# EAGLE design room_sensor (EAGLE 9.6.2)
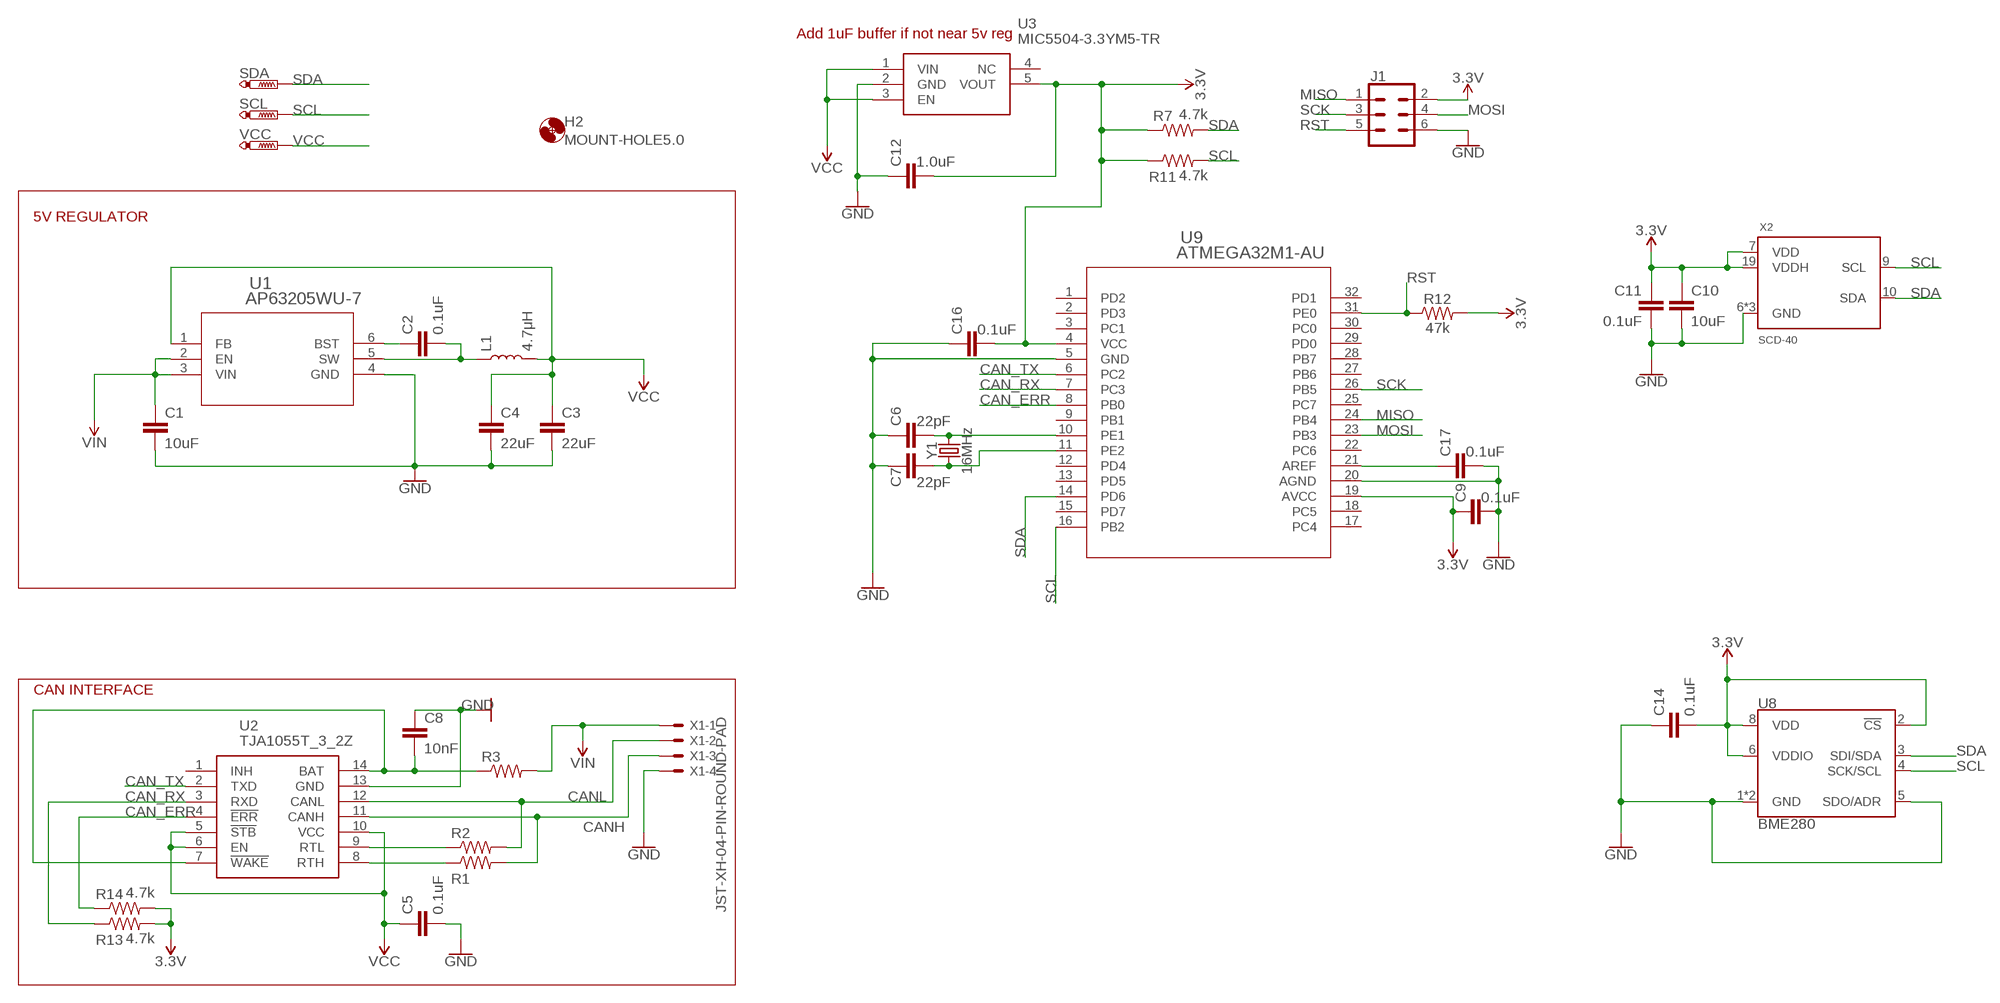
[diagram p0: schematic, sheet 1]

## Parts
C1  10uF  10UF-1210-50V-20%  [1210]
C2  0.1uF  0.1UF-0603-25V-5%  [0603]
C3  22uF  22UF-0805-6.3V-20%  [0805]
C4  22uF  22UF-0805-6.3V-20%  [0805]
C5  0.1uF  0.1UF-0603-25V-5%  [0603]
C6  22pF  22PF-0603-50V-5%  [0603]
C7  22pF  22PF-0603-50V-5%  [0603]
C8  10nF  10NF-0603-50V-10%  [0603]
C9  0.1uF  0.1UF-0603-25V-5%  [0603]
C10  10uF  10UF-1210-50V-20%  [1210]
C11  0.1uF  0.1UF-0603-25V-5%  [0603]
C12  1.0uF  1.0UF-0603-16V-10%  [0603]
C14  0.1uF  0.1UF-0603-25V-5%  [0603]
C16  0.1uF  0.1UF-0603-25V-5%  [0603]
C17  0.1uF  0.1UF-0603-25V-5%  [0603]
H2  MOUNT-HOLE5.0  [5,0]
J1  CONN_03X2NO_SILK  [2X3-NS]
L1  4.7μH  4.7μH_SHIELDED_INDUCTORNPIS_LS  [INDUCTOR_4X4MM]
R1  RESISTOR0603  [0603]
R2  RESISTOR0603  [0603]
R3  RESISTOR0603  [0603]
R7  4.7k  4.7KOHM-0603-1/10W-1%  [0603]
R11  4.7k  4.7KOHM-0603-1/10W-1%  [0603]
R12  47k  47KOHM-0603-1/10W-1%  [0603]
R13  4.7k  4.7KOHM-0603-1/10W-1%  [0603]
R14  4.7k  4.7KOHM-0603-1/10W-1%  [0603]
SCL  PTR1B1,27  [B1,27]
SDA  PTR1B1,27  [B1,27]
U1  AP63205WU-7  [SOIC_05WU-7_DIO]
U2  TJA1055T_3_2Z  [SOIC127P600X175-14N]
U3  MIC5504-3.3YM5-TR  [SOT95P280X145-5N]
U8  BME280  [LGA-8-2.5X2.5]
U9  ATMEGA32M1-AU  [32A_ATM]
VCC  PTR1B1,27  [B1,27]
X1  JST-XH-04-PIN-ROUND-PAD  [JST-XH-04-PACKAGE-ROUND-PAD]
X2  SCD-40  [SCD40]
Y1  16MHz  CRYSTAL-16MHZSMD-5X3.2  [CRYSTAL-SMD-5X3.2-4PAD]

## Nets
3.3V: C9.1 C10.1 C11.2 C12.2 C14.2 C16.2 J1.2 R7.1 R11.1 R12.2 R13.2 R14.2 U3.5(VOUT) U8.2(!CS) U8.6(VDDIO) U8.8(VDD) U9.4(VCC) U9.19(AVCC) X2.7(VDD) X2.19(VDDH)
CAN_ERR: R14.1 U2.4(!ERR) U9.8(PB0)
CAN_RX: R13.1 U2.3(RXD) U9.7(PC3)
CAN_TX: U2.2(TXD) U9.6(PC2)
CANH: R1.2 U2.11(CANH) X1.3
CANL: R2.2 U2.12(CANL) X1.2
GND: C1.2 C3.2 C4.2 C5.2 C6.1 C7.1 C8.1 C9.2 C10.2 C11.1 C12.1 C14.1 C16.1 C17.2 J1.6 U1.4(GND) U2.13(GND) U3.2(GND) U8.1(GND) U8.5(SDO/ADR) U8.7(GND) U9.5(GND) U9.20(AGND) X1.4 X2.6(GND) X2.20(GND) X2.P$1(GND)
MISO: J1.1 U9.24(PB4)
MOSI: J1.4 U9.23(PB3)
N$1: C2.2 L1.P$1 U1.5(SW)
N$2: C2.1 U1.6(BST)
N$3: C6.2 U9.10(PE1) Y1.3
N$4: C7.2 U9.11(PE2) Y1.1
N$5: R2.1 U2.9(RTL)
N$6: R1.1 U2.8(RTH)
N$8: C8.2 R3.1 U2.7(!WAKE) U2.14(BAT)
N$20: C17.1 U9.21(AREF)
RST: J1.5 R12.1 U9.31(PE0)
SCK: J1.3 U9.26(PB5)
SCL: R11.2 SCL.TP U8.4(SCK/SCL) U9.16(PB2) X2.9(SCL)
SDA: R7.2 SDA.TP U8.3(SDI/SDA) U9.14(PD6) X2.10(SDA)
VCC: C3.1 C4.1 C5.1 L1.P$2 U1.1(FB) U2.5(!STB) U2.6(EN) U2.10(VCC) U3.1(VIN) U3.3(EN) VCC.TP
VIN: C1.1 R3.2 U1.2(EN) U1.3(VIN) X1.1
Unconnected: U2.1(INH) U3.4(NC) U9.1(PD2) U9.2(PD3) U9.3(PC1) U9.9(PB1) U9.12(PD4) U9.13(PD5) U9.15(PD7) U9.17(PC4) U9.18(PC5) U9.22(PC6) U9.25(PC7) U9.27(PB6) U9.28(PB7) U9.29(PD0) U9.30(PC0) U9.32(PD1)

## Notes on the sheet
- Add 1uF buffer if not near 5v reg
- 5V REGULATOR
- CAN INTERFACE

## Library data of the parts
C1 C10 = SparkFun-Capacitors:10UF: 10.0µF ceramic capacitors A capacitor is a passive two-terminal electrical component used to store electrical energy temporarily in an electric field.; PROD_ID: CAP-09824
C2 C5 C9 C11 C14 C16 C17 = SparkFun-Capacitors:0.1UF: 0.1µF ceramic capacitors A capacitor is a passive two-terminal electrical component used to store electrical energy temporarily in an electric field.; PROD_ID: CAP-08604
C3 C4 = SparkFun-Capacitors:22UF: 22µF ceramic capacitors A capacitor is a passive two-terminal electrical component used to store electrical energy temporarily in an electric field.; PROD_ID: CAP-08402
C6 C7 = SparkFun-Capacitors:22PF: 22pF ceramic capacitors A capacitor is a passive two-terminal electrical component used to store electrical energy temporarily in an electric field.; PROD_ID: CAP-07876
C8 = SparkFun-Capacitors:10NF: 0.01uF/10nF/10,000pF ceramic capacitors A capacitor is a passive two-terminal electrical component used to store electrical energy temporarily in an electric field. CAP-09321; PROD_ID: CAP-00867
C12 = SparkFun-Capacitors:1.0UF: 1µF ceramic capacitors A capacitor is a passive two-terminal electrical component used to store electrical energy temporarily in an electric field.; PROD_ID: CAP-00868
H2 = holes:MOUNT-HOLE: MOUNTING HOLE with drill center marker
J1 = SparkFun-Connectors:CONN_03X2: Multi connection point. Often used as Generic Header-pin footprint for 0.1 inch spaced/style header connections You can populate with any combo of single row headers, but if you'd like an exact match, check these: Header - 2x3 (Male, 0.1") <https://www.sparkfun.com/products/12807> (PRT-12807) Header - 2x3 (Female, 0.1") <https://www.sparkfun.com/products/13010> (PRT-13010) 2x3 Pin Shrouded Header <https://www.sparkfun.com/products/10877> (PRT-10877) On any of the 0.1 inch spaced packages, you can populate with these: Break Away Headers - Straight <https://www.sparkfun.com/products/116> (PRT-00116) Break Away Male Headers - Right Angle <https://www.sparkfun.com/products/553> (PRT-00553) Female Headers <https://www.sparkfun.com/products/115> (PRT-00115) Break Away Headers - Machine Pin <https://www.sparkfun.com/products/117> (PRT-00117) Break Away Female Headers - Swiss Machine Pin <https://www.sparkfun.com/products/743> (PRT-00743) Special note: the shrouded connector mates well with our 3x2 ribbon cables: Ribbon Crimp Connector - 6-pin (2x3, Female) <https://www.sparkfun.com/products/10651> (PRT-10651) Ribbon Cable - 6 wire (15ft) <https://www.sparkfun.com/products/10646> (PRT-10646)
L1 = SparkFun-Coils:4.7μH_SHIELDED_INDUCTOR: 4.7uH Inductor 4.7uH 1.4A 50mOhm 1008(2520) Package Shielded; PROD_ID: NDUC-15245
R1-R3 = SparkFun-Resistors:RESISTOR: Generic Resistor Package
R7 R11 R13 R14 = SparkFun-Resistors:4.7KOHM: 4.7kΩ resistor A resistor is a passive two-terminal electrical component that implements electrical resistance as a circuit element. Resistors act to reduce current flow, and, at the same time, act to lower voltage levels within circuits. - Wikipedia; PROD_ID: RES-07857
R12 = SparkFun-Resistors:47KOHM: 47kΩ resistor A resistor is a passive two-terminal electrical component that implements electrical resistance as a circuit element. Resistors act to reduce current flow, and, at the same time, act to lower voltage levels within circuits. - Wikipedia; PROD_ID: RES-07871
SCL SDA VCC = testpad:PTR1: TEST PIN
U1 = Diodes buck converter:AP63205WU-7; COPYRIGHT: Copyright (C) 2023 Ultra Librarian. All rights reserved.; MANUFACTURER_PART_NUMBER: AP63205WU-7; MFR_NAME: Diodes Inc
U2 = TJA1055T_3_2Z:TJA1055T_3_2Z: CAN Interface IC Enhanced fault-tolerant CAN transceiver Source: Datasheet <http://www.nxp.com/docs/en/data-sheet/TJA1055.pdf>; DESCRIPTION: CAN Interface IC Enhanced fault-tolerant CAN transceiver; HEIGHT: 1.75mm; MANUFACTURER_NAME: NXP; MANUFACTURER_PART_NUMBER: TJA1055T/3/2Z; MOUSER_PART_NUMBER: 771-TJA1055T/3/2Z; MOUSER_PRICE-STOCK: https://www.mouser.co.uk/ProductDetail/NXP-Semiconductors/TJA1055T-3-2Z?qs=qSfuJ%252Bfl%2Fd73Y%2FIsMw3Ayg%3D%3D
U3 = MIC5504-3.3YM5-TR:MIC5504-3.3YM5-TR: MICROCHIP - MIC5504-3.3YM5-TR - LDO VOLT REG, 0.3A, 3.3V, SOT-23-5 Source: Datasheet <https://componentsearchengine.com/Datasheets/2/MIC5504-3.3YM5-TR.pdf>; DESCRIPTION: MICROCHIP - MIC5504-3.3YM5-TR - LDO VOLT REG, 0.3A, 3.3V, SOT-23-5; HEIGHT: 1.45mm; MANUFACTURER_NAME: Microchip; MANUFACTURER_PART_NUMBER: MIC5504-3.3YM5-TR; MOUSER_PART_NUMBER: 998-MIC5504-3.3YM5TR; MOUSER_PRICE-STOCK: https://www.mouser.co.uk/ProductDetail/Microchip-Technology/MIC5504-3.3YM5-TR?qs=U6T8BxXiZAUmVQ5Zs217qQ%3D%3D
U8 = SparkFun-Sensors:BME280: Bosch BME280 – Combined Humidity and Pressure Sensor The BME280 is as combined digital humidity, pressure and temperature sensor based on proven sensing principles. The sensor module is housed in an extremely compact metal-lid LGA package with a footprint of only 2.5×2.5mm² with a height of 0.93mm. Its small dimensions and its low power consumption allow the implementation in battery driven devices such as handsets, GPS modules or watches. Datasheet <https://cdn.sparkfun.com/assets/learn_tutorials/4/1/9/BST-BME280_DS001-10.pdf> SparkFun Products SparkFun Atmospheric Sensor Breakout - BME280 <https://www.sparkfun.com/products/13676> (SEN-13676); PROD_ID: IC-13090
U9 = ATMEGA31M1-AU:ATMEGA32M1-AU; COPYRIGHT: Copyright (C) 2023 Ultra Librarian. All rights reserved.; MANUFACTURER_PART_NUMBER: ATMEGA32M1-AU; MFR_NAME: Microchip
X1 = Rembrandt Electronics - JST XH Connectors v1-0:JST-XH-04-PIN: JST XH Connector 2 Pin Wire to board connector. Pitch: 2,54 mm, (0.100") Number of pins: 4 Created by Rembrandt Electronics www.rembrandtelectronics.com
X2 = Adafruit SCD-41:SCD-40
Y1 = SparkFun-Clocks:CRYSTAL-16MHZ: 16MHz Crystal Digikey Example <http://www.digikey.com/product-search/en?keywords=535-9122-1-ND> Frequency: 16MHz Frequency Stability: ±50ppm Frequency Tolerance: ±20ppm Load Capacitance: 18pF SparkFun Products: Pro Micro -5V/16MHz <https://www.sparkfun.com/products/12640> SparkFun Serial Enabled LCD Kit <https://www.sparkfun.com/products/10097>; PROD_ID: XTAL-08218; SF_ID: COM-00094

## Board
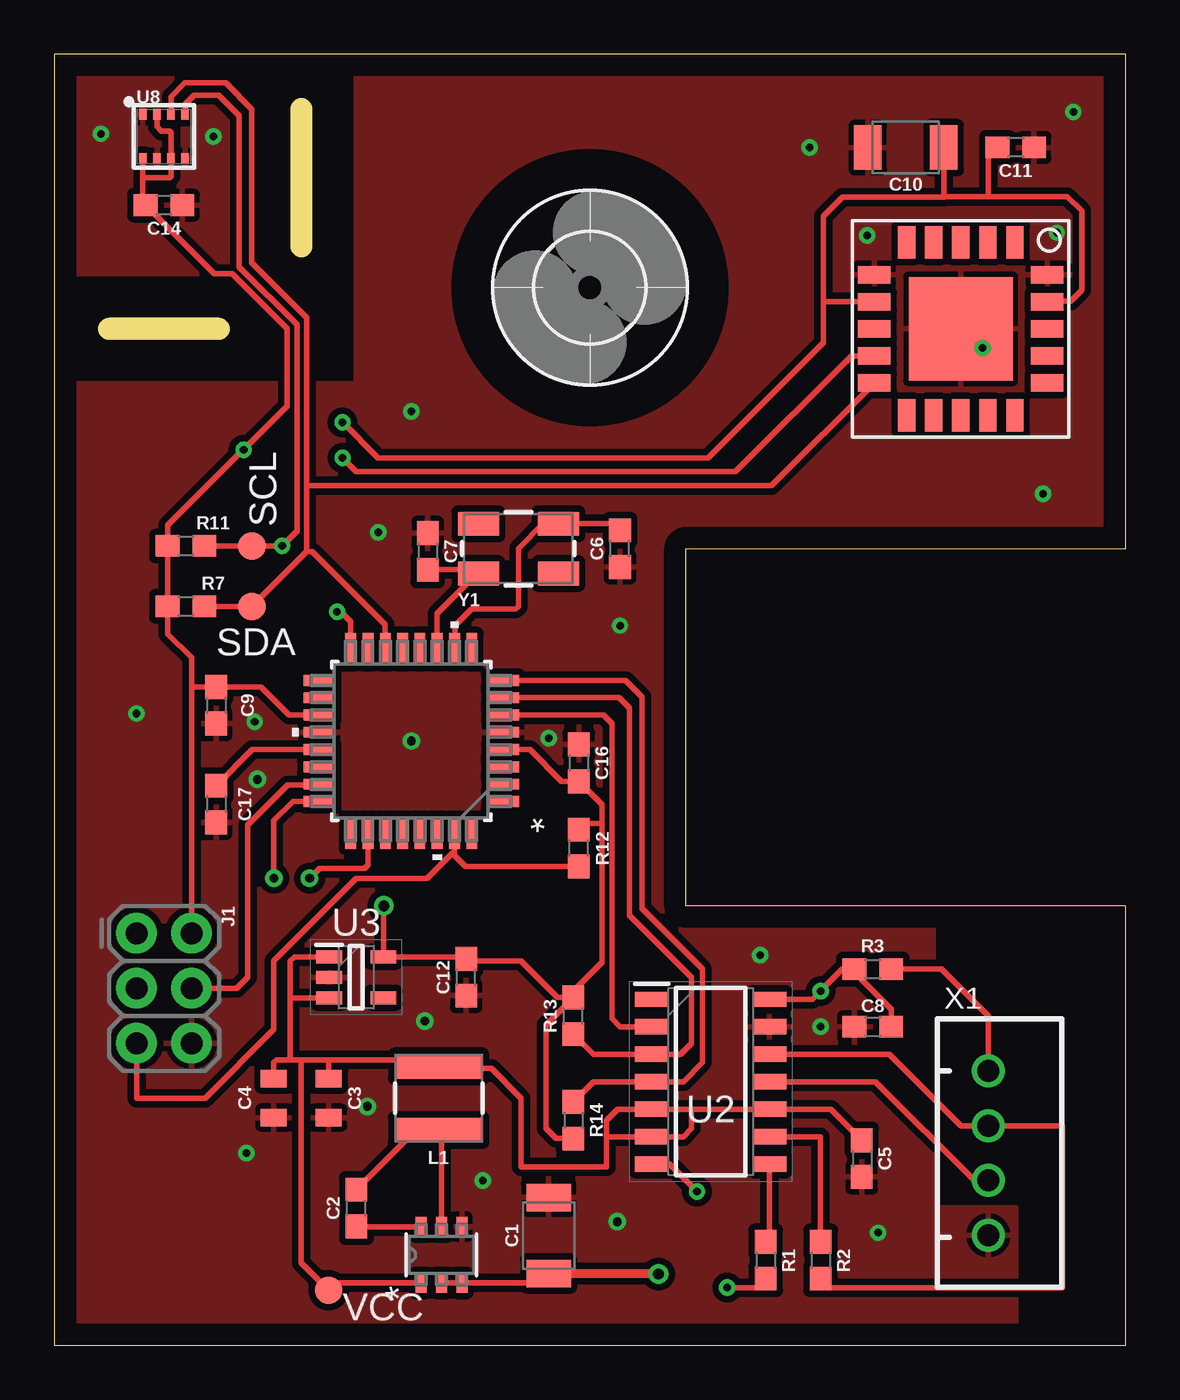
[diagram p1: board, top side]
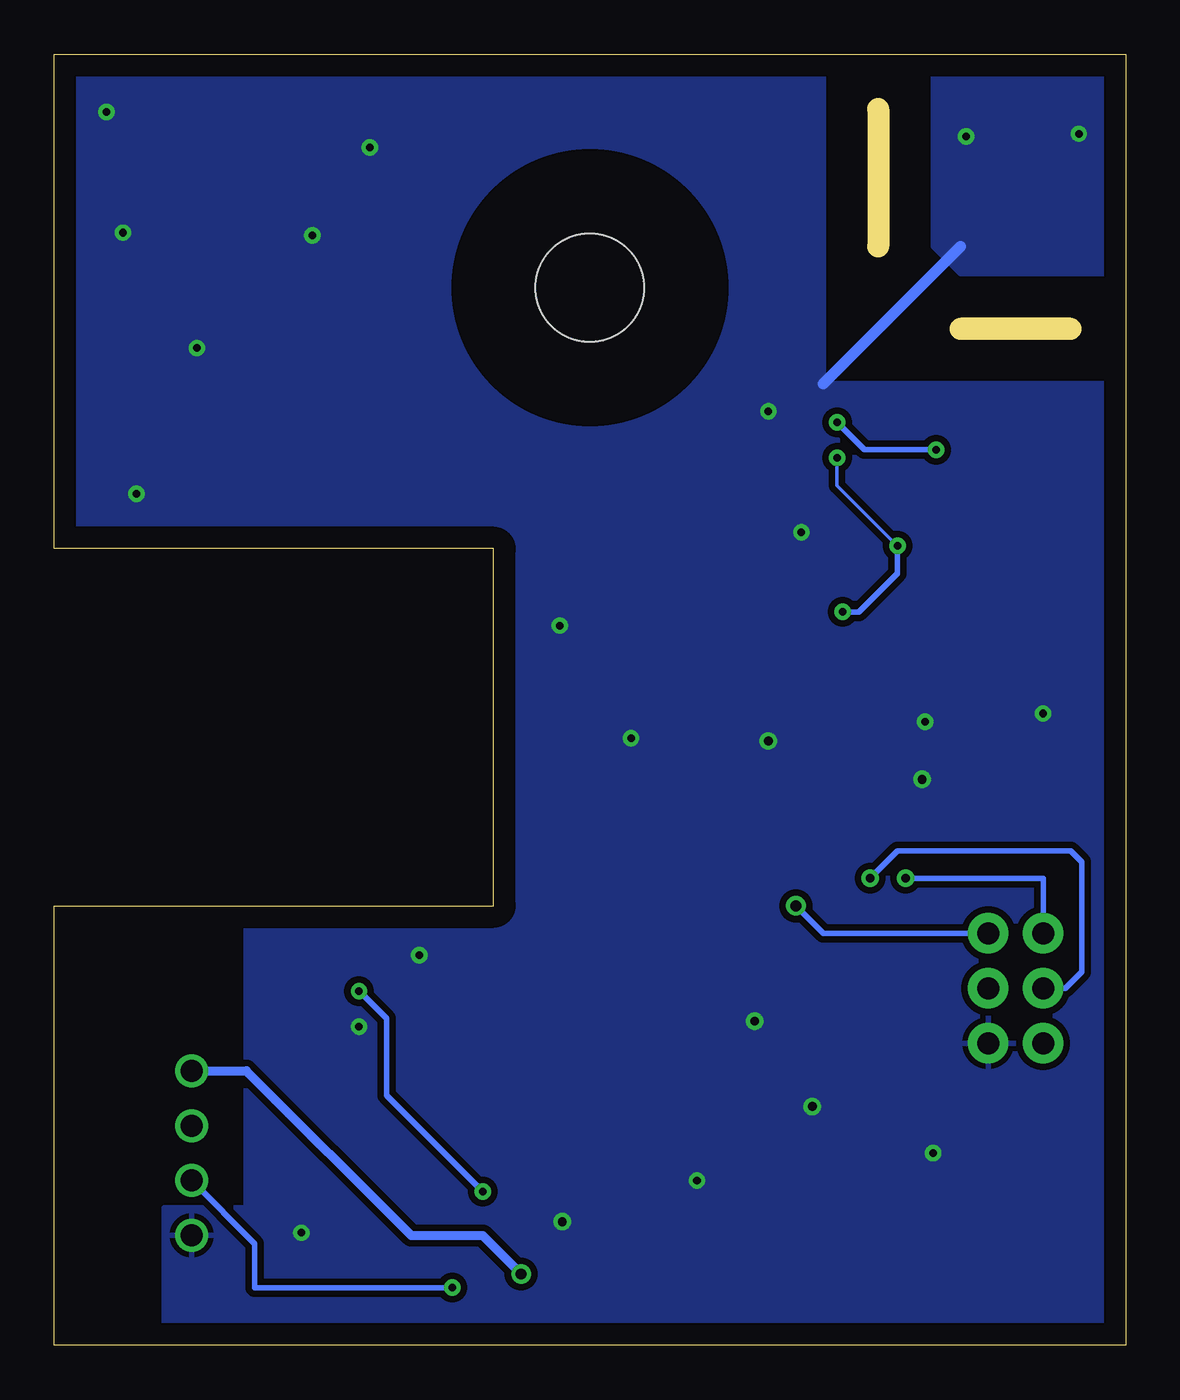
[diagram p2: board, bottom side, seen from below]

Size 49.53 x 59.69 mm. Coordinates in mm from the lower left corner, seen from the top.
Outline: 49.28,59.69 0,59.68
Outline: 0,59.68 0,0 49.53,0 49.53,20.32 29.21,20.32 29.21,36.83 49.53,36.83 49.53,59.69 49.28,59.69
Outline: 49.28,59.69 0,59.69 0,59.68
Outline: 2.54,46.99 7.62,46.99
Outline: 11.43,57.15 11.43,50.8
Copper layers (1*16): Top 0.035mm / dielectric 1.5mm / Bottom 0.035mm
Design rules "default": minimum track width 6mil, minimum drill 0.35mm, track to track 6mil, track to pad 6mil, pad to pad 6mil, via to via 6mil, smd to smd 6mil, copper to edge 40mil, drill to drill 6mil, minimum pad ring 10mil, minimum via ring 8mil, stop-mask expansion 4mil, vias tented up to drill 0mil, thermal gap 10mil
Milling: 2 lines

### Footprints (pad centres in the part's own frame; a part is rotated, then mirrored left to right if it is on the bottom)
1210 = smd 1.27 x 2.06: 1 -1.755,0; 2 1.755,0
0603 = smd 1.1 x 1: 1 -0.85,0; 2 0.85,0
0805 = smd 0.8 x 1.2: 1 -0.9,0; 2 0.9,0
5,0 = hole 5: 0,0
2X3-NS = drill 1.016 pad 1.88: 1 -2.54,-1.27; 2 -2.54,1.27; 3 0,-1.27; 4 0,1.27; 5 2.54,-1.27; 6 2.54,1.27
INDUCTOR_4X4MM = smd 4.089 x 1.143: P$1 0,1.473; P$2 0,-1.473
B1,27 = smd 1.27 x 1.27: TP 0,0
SOIC_05WU-7_DIO = smd 0.902 x 0.508: 1 -1.302,0.95; 2 -1.302,0; 3 -1.302,-0.95; 4 1.302,-0.95; 5 1.302,0; 6 1.302,0.95
SOIC127P600X175-14N = smd 1.55 x 0.7: 1 -2.725,3.81; 2 -2.725,2.54; 3 -2.725,1.27; 4 -2.725,0; 5 -2.725,-1.27; 6 -2.725,-2.54; 7 -2.725,-3.81; 8 2.725,-3.81; 9 2.725,-2.54; 10 2.725,-1.27; 11 2.725,0; 12 2.725,1.27; 13 2.725,2.54; 14 2.725,3.81
SOT95P280X145-5N = smd 1.2 x 0.6: 1 -1.25,0.95; 2 -1.25,0; 3 -1.25,-0.95; 4 1.25,-0.95; 5 1.25,0.95
LGA-8-2.5X2.5 = smd 0.35 x 0.5: 1 -0.975,1.025; 2 -0.325,1.025; 3 0.325,1.025; 4 0.975,1.025; 5 0.975,-1.025; 6 0.325,-1.025; 7 -0.325,-1.025; 8 -0.975,-1.025
32A_ATM = smd 1.461 x 0.501: 1 -4.25,2.8; 2 -4.25,2; 3 -4.25,1.2; 4 -4.25,0.4; 5 -4.25,-0.4; 6 -4.25,-1.2; 7 -4.25,-2; 8 -4.25,-2.8; 17 4.25,-2.8; 18 4.25,-2; 19 4.25,-1.2; 20 4.25,-0.4; 21 4.25,0.4; 22 4.25,1.2; 23 4.25,2; 24 4.25,2.8 | smd 0.501 x 1.461: 9 -2.8,-4.25; 10 -2,-4.25; 11 -1.2,-4.25; 12 -0.4,-4.25; 13 0.4,-4.25; 14 1.2,-4.25; 15 2,-4.25; 16 2.8,-4.25; 25 2.8,4.25; 26 2,4.25; 27 1.2,4.25; 28 0.4,4.25; 29 -0.4,4.25; 30 -1.2,4.25; 31 -2,4.25; 32 -2.8,4.25
JST-XH-04-PACKAGE-ROUND-PAD = drill 1.016: 1 -3.81,0; 2 -1.27,0; 3 1.27,0; 4 3.81,0
SCD40 = smd 1.5 x 0.8: 1 -4,2.5; 2 -4,1.25; 3 -4,0; 4 -4,-1.25; 5 -4,-2.5; 11 4,-2.5; 12 4,-1.25; 13 4,0; 14 4,1.25; 15 4,2.5 | smd 0.8 x 1.5: 6 -2.5,-4; 7 -1.25,-4; 8 0,-4; 9 1.25,-4; 10 2.5,-4; 16 2.5,4; 17 1.25,4; 18 0,4; 19 -1.25,4; 20 -2.5,4 | smd 4.8 x 4.8: P$1 0,0
CRYSTAL-SMD-5X3.2-4PAD = smd 1.9 x 1.1: 1 -1.85,-1.15; 2 1.85,-1.15; 3 1.85,1.15; 4 -1.85,1.15

### Placement (x,y rotation side)
C1  22.86,5.08 90 top
C2  13.97,6.35 90 top
C3  12.7,11.43 270 top
C4  10.16,11.43 270 top
C5  37.34,8.64 270 top
C6  26.16,36.83 90 top
C7  17.27,36.7 270 top
C8  37.85,14.73 0 top
C9  7.49,29.59 270 top
C10  39.37,55.37 180 top
C11  44.45,55.37 180 top
C12  19.05,17.02 90 top
C14  5.08,52.7 180 top
C16  24.26,26.92 270 top
C17  7.49,25.02 270 top
H2  24.77,48.9 0 top
J1  5.08,16.51 270 top
L1  17.78,11.43 180 top
R1  32.89,3.94 270 top
R2  35.43,3.94 270 top
R3  37.85,17.4 0 top
R7  6.1,34.16 0 top
R11  6.1,36.96 0 top
R12  24.26,22.99 90 top
R13  24,15.24 90 top
R14  24,10.41 270 top
SCL  9.14,36.96 0 top
SDA  9.14,34.16 0 top
U1  17.91,4.19 90 top
U2  30.35,12.19 0 top
U3  13.97,17.02 0 top
U8  5.08,55.88 0 top
U9  16.51,27.94 180 top
VCC  12.7,2.54 0 top
X1  43.18,8.89 270 top
X2  41.91,46.99 270 top
Y1  21.46,36.83 0 top

### Tracks (layer width: path | path; a pad name or v marks a point on that pad's centre or on a via)
3.3V  (via drill 0.35, 0.5)
  Top 0.254: U8.8 4.11,53.98 | 4.11,53.98 4.11,52.83 C14.2 7.41,49.53 8.23,49.53 10.77,46.99 10.77,43.41 v8.76,41.4 8.73,41.4 5.25,37.92 R11.1 R7.1 5.25,32.89 6.35,31.79 6.35,30.44 | 4.11,53.98 5.33,53.98 5.41,54.05 U8.6 5.41,56.06 5.33,56.13 4.95,56.13 4.75,56.33 U8.2 | R13.2 22.73,14.82 22.73,10.03 23.2,9.56 R14.2 | R13.2 23.28,16.09 21.59,17.78 19.14,17.78 C12.2 18.95,17.97 U3.5 15.24,17.99 v15.24,20.32 | R13.2 24,16.38 25.32,17.7 25.32,24.13 | 25.32,24.13 25.32,25.01 C16.2 23.46,26.07 21.99,27.54 U9.4 | R12.2 24.55,24.13 25.32,24.13 | U9.19 10.87,29.14 9.56,30.44 C9.1 6.35,30.44 | 6.35,30.44 J1.2 | X2.19 45.93,48.26 46.99,48.26 47.5,48.77 47.5,52.45 46.84,53.11 43.18,53.11 | C11.2 43.18,54.95 43.18,53.11 | X2.7 35.56,48.24 | 35.56,48.24 35.56,52.2 36.45,53.09 41.12,53.09 | C10.1 41.12,53.09 | 35.56,48.24 35.56,46.35 30.23,41.02 14.99,41.02 v13.34,42.67 | 43.18,53.11 41.15,53.11 41.12,53.09
  Bottom 0.254: J1.2 13.97,19.05 v15.24,20.32 | v8.76,41.4 12.06,41.4 v13.34,42.67
CAN_ERR
  Top 0.254: U9.8 26.41,30.74 27.18,29.97 27.18,20.19 29.97,17.4 29.97,13.08 29.08,12.19 U2.4 24.93,12.19 R14.1
CAN_RX
  Top 0.254: U9.7 26.12,29.94 26.59,29.46 26.59,19.88 29.46,17.01 29.46,13.97 28.96,13.46 U2.3 24.93,13.46 R13.1
CAN_TX
  Top 0.254: U2.2 26.16,14.73 25.78,15.11 25.78,28.76 25.4,29.14 U9.6
CANH  (via drill 0.35)
  Top 0.254: X1.3 42.55,7.62 37.97,12.19 U2.11 | R1.2 32.47,2.67 v31.11,2.67
  Bottom 0.254: v31.11,2.67 40.26,2.67 40.26,4.7 X1.3
CANL
  Top 0.254: U2.12 38.61,13.46 41.91,10.16 X1.2 46.61,10.16 46.61,2.67 35.85,2.67 35.77,2.75 R2.2
GND  (via drill 0.35, 0.4)
  Bottom 0.508: 7.62,50.8 13.97,44.45
  other vias: 2.16,56.01 7.37,55.88 14.48,11.05 9.4,26.16 17.14,14.99 26.04,5.71 16.51,27.94 46.35,51.44 37.59,51.31 42.93,46.1 34.92,55.37 47.12,57.02 14.99,37.59 26.16,33.27 9.27,28.83 22.86,28.07 8.89,8.89 19.81,7.62 35.43,14.73 32.64,18.03 3.81,29.21 16.51,43.18 45.72,39.37 38.1,5.21
  pour Top (isolate 0.305): 0,59.69 8.89,59.69 8.89,50.67 7.75,49.53 0,49.53
  pour Bottom (isolate 0.305): 0,59.69 0,49.53 7.62,49.53 8.89,50.8 8.89,59.69
  pour Bottom (isolate 0.305): 0,44.45 13.97,44.45 13.97,59.69 49.53,59.69 49.53,20.32 40.64,20.32 40.64,6.35 44.45,6.35 44.45,0 0,0
  pour Top (isolate 0.305): 0,44.45 13.97,44.45 13.97,59.69 49.53,59.69 49.53,20.32 40.64,20.32 40.64,6.35 44.45,6.35 44.45,0 0,0
MISO  (via drill 0.4)
  Top 0.254: U9.24 11.04,25.14 10.16,24.26 v10.16,21.59
  Bottom 0.254: v10.16,21.59 3.81,21.59 J1.1
MOSI
  Top 0.254: U9.23 12.23,25.91 10.79,25.91 8.94,24.05 8.94,17.02 8.43,16.51 J1.4
N$1
  Top 0.254: U1.5 17.91,9.83 L1.P$1 16.73,9.96 C2.2
N$2
  Top 0.254: C2.1 U1.6
N$3
  Top 0.254: U9.10 18.54,32.22 18.54,33.27 19.3,34.04 21.34,34.04 21.46,34.16 21.46,36.83 22.61,37.98 Y1.3 25.86,37.98 C6.2
N$4
  Top 0.254: U9.11 17.71,33.84 19.55,35.68 | 19.55,35.68 Y1.1 | C7.2 19.38,35.85 19.55,35.68
N$5
  Top 0.254: U2.9 35.43,9.65 R2.1
N$6
  Top 0.254: R1.1 33.08,4.75 U2.8
N$8  (via drill 0.35)
  Top 0.254: U2.14 35.05,16 v35.43,16.38 36.45,17.4 R3.1 37,17.23 38.7,15.53 C8.2 | v29.72,7.11 28.45,8.38 U2.7
  Bottom 0.254: v29.72,7.11 34.16,11.56 34.16,15.11 v35.43,16.38
N$20
  Top 0.254: C17.1 9.16,27.54 U9.21
RST
  Top 0.254: R12.1 19.01,22.14 18.51,22.64 18.51,22.86 | 18.51,22.86 U9.31 | 18.51,22.86 17.24,21.59 13.97,21.59 10.16,17.78 10.16,14.61 6.99,11.43 3.81,11.43 J1.5
SCK  (via drill 0.4)
  Top 0.254: U9.26 14.51,22.21 14.35,22.05 12.27,22.05 v11.81,21.59
  Bottom 0.254: v11.81,21.59 10.54,22.86 2.54,22.86 2.03,22.35 2.03,17.27 2.79,16.51 J1.3
SCL  (via drill 0.35)
  Top 0.254: R11.2 SCL.TP v10.54,36.96 11.23,37.64 11.23,47.18 8.56,49.85 8.56,56.83 7.61,57.78 6.48,57.78 6.05,57.36 U8.4 | v13.08,33.91 13.26,33.91 13.71,33.46 U9.16 | v13.34,41.02 13.97,40.39 31.5,40.39 36.85,45.74 X2.9
  Bottom 0.152: v10.54,36.96 13.34,39.75 v13.34,41.02
  Bottom 0.254: v13.08,33.91 12.32,33.91 10.54,35.69 v10.54,36.96
SDA
  Top 0.254: U8.3 5.41,57.73 6.04,58.37 7.92,58.37 9.14,57.15 9.14,50.04 11.68,47.5 11.68,39.75 | 11.68,36.7 SDA.TP R7.2 | 11.68,39.75 11.68,36.7 | U9.14 15.31,33.33 11.94,36.7 11.68,36.7 | X2.10 33.17,39.75 11.68,39.75
VCC
  Top 0.254: C5.1 35.9,10.92 U2.10 29.46,10.92 | 29.46,10.92 U2.5 26.04,10.92 25.53,10.41 25.53,9.65 | 12.7,13.21 C3.1 | 12.7,13.21 17.48,13.21 L1.P$2 17.88,12.8 20.22,12.8 21.59,11.43 21.59,8.26 25.53,8.26 25.53,9.65 | C4.1 10.16,13.08 10.29,13.21 10.92,13.21 | 10.92,13.21 11.43,13.21 | 11.43,13.21 12.7,13.21 | 11.43,13.21 11.43,3.81 VCC.TP 13.05,2.89 U1.1 | 10.92,13.21 10.92,16 | 10.92,16 10.92,17.78 11.11,17.97 U3.1 | 25.53,9.65 U2.6 29.08,9.65 29.46,10.03 29.46,10.92 | U3.3 10.99,16.07 10.92,16
VIN  (via drill 0.5)
  Top 0.254: U1.2 U1.3 22.47,2.89 22.88,3.3 | X1.1 43.18,15.24 41.02,17.4 R3.2
  Top 0.406: v27.94,3.3 22.88,3.3 C1.1
  Bottom 0.406: X1.1 40.64,12.7 33.02,5.08 29.72,5.08 v27.94,3.3